# EAGLE design mLRS-rx-E22-G4-v007 (EAGLE 7.5.0)
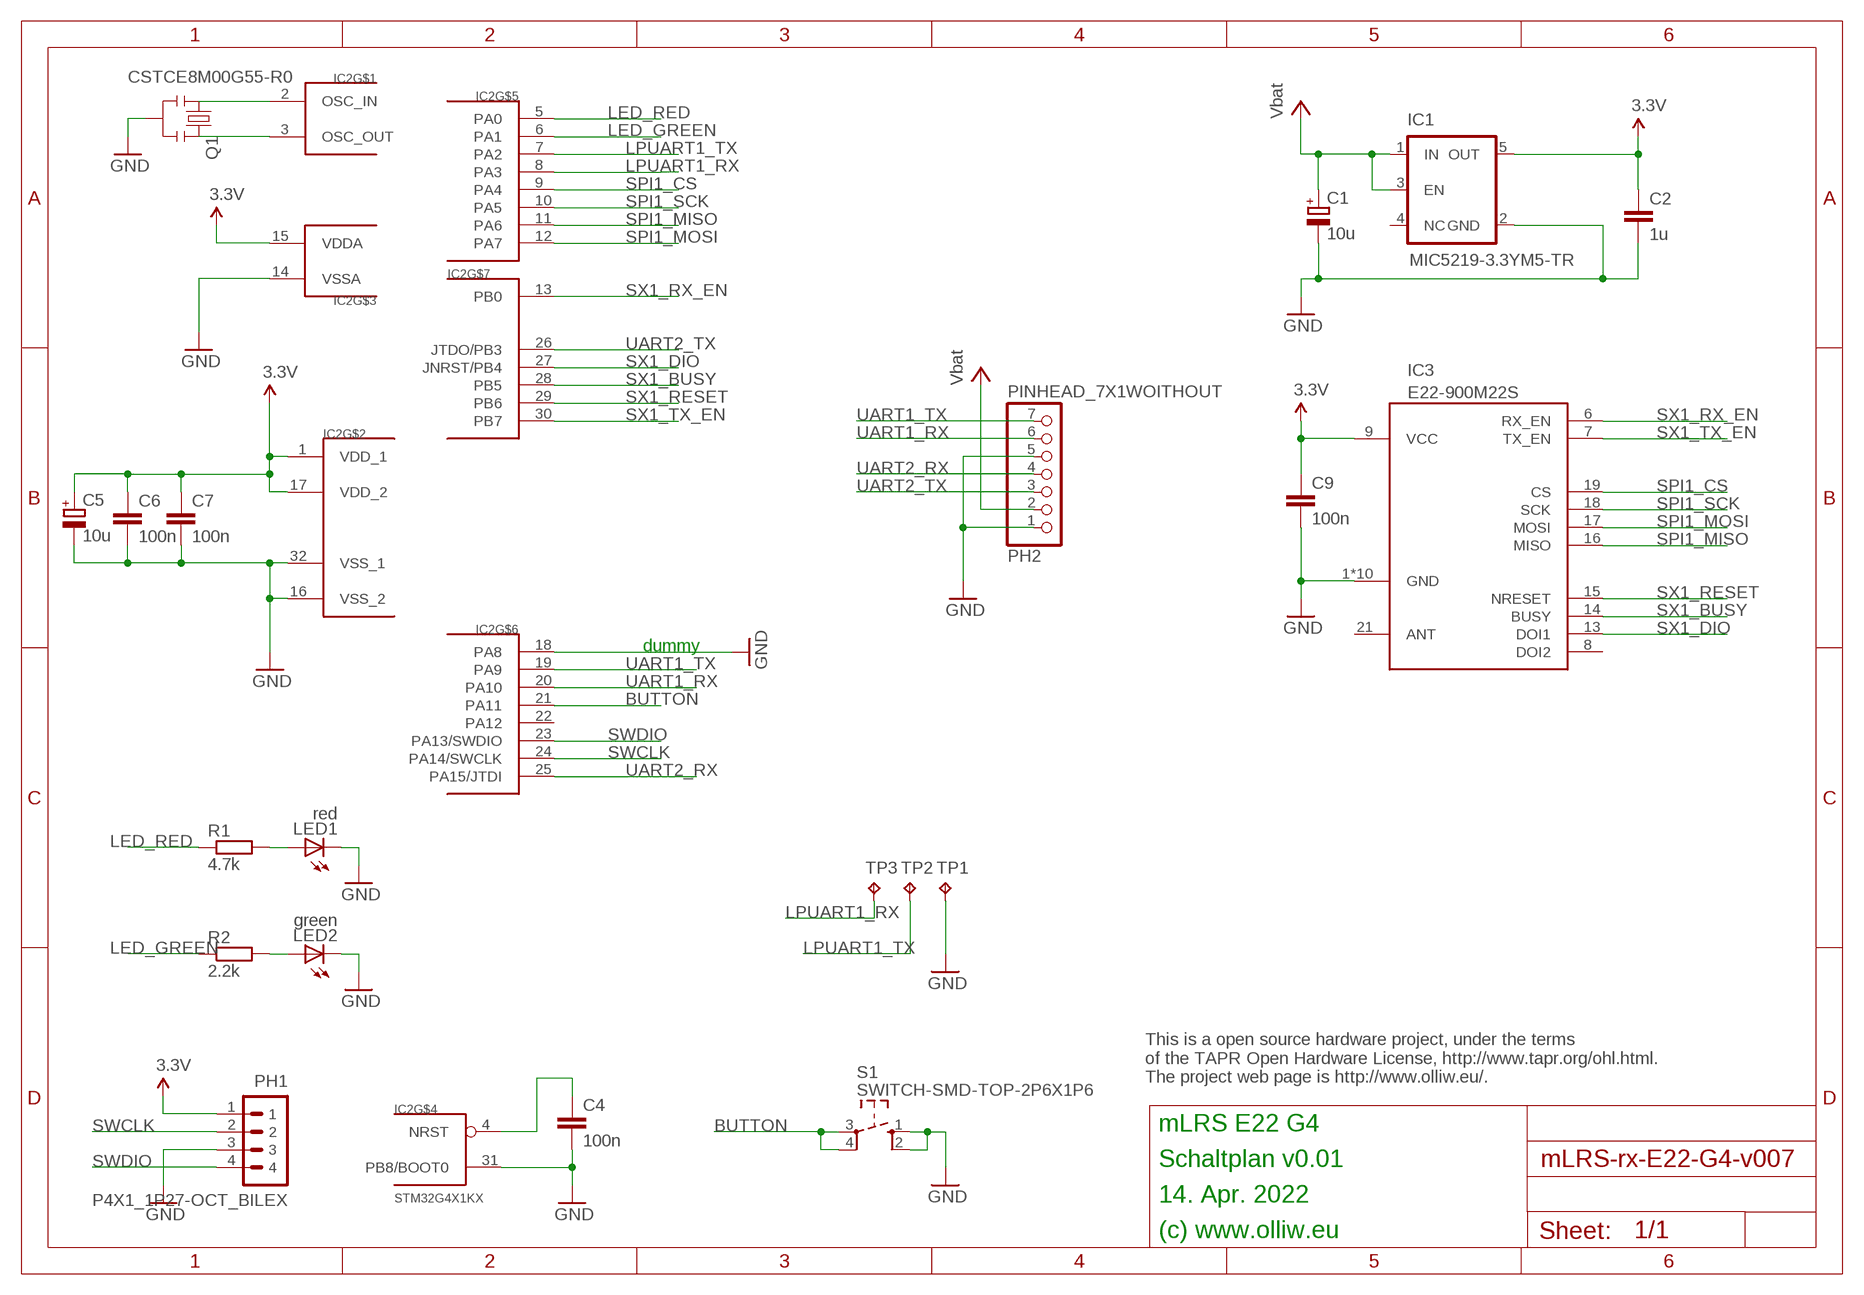
[diagram p0: schematic, sheet 1]

## Parts
C1  10u  CPOL-EUSMCA  [SMC_A]
C2  1u  C-EUC0603K  [C0603K]
C4  100n  C-EUC0402  [C0402]
C5  10u  CPOL-EUSMCA  [SMC_A]
C6  100n  C-EUC0402  [C0402]
C7  100n  C-EUC0402  [C0402]
C9  100n  C-EUC0402  [C0402]
IC1  MIC5219-3.3YM5-TR  V_REG_TPS76433SOT23-5  [SOT23-5]
IC2  STM32G4X1KX  [UFQFPN32]
IC3  E22-900M22S  [E22-900M22S]
LED1  red  LEDCHIPLED_0603  [CHIPLED_0603]
LED2  green  LEDCHIPLED_0603  [CHIPLED_0603]
PH1  P4X1_1P27-OCT_BILEX  [4X1_1P27_OCT_BILEX]
PH2  PINHEAD_7X1WOITHOUT  [PINHEAD_7X1_WO]
Q1  CSTCE8M00G55-R0  RESONATORSMD  [RESONATOR-SMD]
R1  4.7k  R-EU_R0402  [R0402]
R2  2.2k  R-EU_R0402  [R0402]
S1  SWITCH-SMD-TOP-2P6X1P6  [TACTILE-SWITCH-SMD-TOP-2P6X1X6]
TP1  TPB1,27  [B1,27]
TP2  TPB1,27  [B1,27]
TP3  TPB1,27  [B1,27]

## Nets
3.3V: C2.1 C5.+ C6.1 C7.1 C9.1 IC1.5(OUT) IC2.1(VDD_1) IC2.15(VDDA) IC2.17(VDD_2) IC3.9(VCC) PH1.1
BUTTON: IC2.21(PA11) S1.3 S1.4
GND: C1.- C2.2 C4.2 C5.- C6.2 C7.2 C9.2 IC1.2(GND) IC2.14(VSSA) IC2.16(VSS_2) IC2.18(PA8) IC2.31(PB8/BOOT0) IC2.32(VSS_1) IC3.1(GND) IC3.2(GND) IC3.3(GND) IC3.4(GND) IC3.5(GND) IC3.10(GND) IC3.11(GND) IC3.12(GND) IC3.20(GND) IC3.22(GND) LED1.C LED2.C PH1.3 PH2.1 PH2.5 Q1.2 S1.1 S1.2 TP1.TP
LED_GREEN: IC2.6(PA1) R2.1
LED_RED: IC2.5(PA0) R1.1
LPUART1_RX: IC2.8(PA3) TP3.TP
LPUART1_TX: IC2.7(PA2) TP2.TP
N$5: C4.1 IC2.4(NRST)
N$12: IC2.3(OSC_OUT) Q1.3
N$14: IC2.2(OSC_IN) Q1.1
N$17: LED1.A R1.2
N$19: LED2.A R2.2
SPI1_CS: IC2.9(PA4) IC3.19(CS)
SPI1_MISO: IC2.11(PA6) IC3.16(MISO)
SPI1_MOSI: IC2.12(PA7) IC3.17(MOSI)
SPI1_SCK: IC2.10(PA5) IC3.18(SCK)
SWCLK: IC2.24(PA14/SWCLK) PH1.2
SWDIO: IC2.23(PA13/SWDIO) PH1.4
SX1_BUSY: IC2.28(PB5) IC3.14(BUSY)
SX1_DIO: IC2.27(JNRST/PB4) IC3.13(DOI1)
SX1_RESET: IC2.29(PB6) IC3.15(NRESET)
SX1_RX_EN: IC2.13(PB0) IC3.6(RX_EN)
SX1_TX_EN: IC2.30(PB7) IC3.7(TX_EN)
UART1_RX: IC2.20(PA10) PH2.6
UART1_TX: IC2.19(PA9) PH2.7
UART2_RX: IC2.25(PA15/JTDI) PH2.4
UART2_TX: IC2.26(JTDO/PB3) PH2.3
VCC: C1.+ IC1.1(IN) IC1.3(EN) PH2.2 ; supply symbol labelled Vbat
Unconnected: IC1.4(NC) IC2.22(PA12) IC3.8(DOI2) IC3.21(ANT)

## Notes on the sheet
- dummy
- This is a open source hardware project, under the terms
  of the TAPR Open Hardware License, http://www.tapr.org/ohl.html.
  The project web page is http://www.olliw.eu/.
- mLRS E22 G4
- Schaltplan v0.01
- 14. Apr. 2022
- (c) www.olliw.eu

## Library data of the parts
C1 C5 = rcl:CPOL-EU: POLARIZED CAPACITOR, European symbol
C2 C4 C6 C7 C9 = rcl:C-EU: CAPACITOR, European symbol
IC1 = # SparkFun2:V_REG_TPS76433: Voltage Regulator Older TI part. LDO 150mA regulator. No output by-pass cap option. See V_REG_LDO for a better part.
IC2 = # stm32:STM32G4X1KX
IC3 = # stdlib:E22-900M22S
LED1 LED2 = led:LED: LED OSRAM: - CHIPLED LG R971, LG N971, LY N971, LG Q971, LY Q971, LO R971, LY R971 LH N974, LH R974 LS Q976, LO Q976, LY Q976 LO Q996 - Hyper CHIPLED LW Q18S LB Q993, LB Q99A, LB R99A - SideLED LS A670, LO A670, LY A670, LG A670, LP A670 LB A673, LV A673, LT A673, LW A673 LH A674 LY A675 LS A676, LA A676, LO A676, LY A676, LW A676 LS A679, LY A679, LG A679 - Hyper Micro SIDELED® LS Y876, LA Y876, LO Y876, LY Y876 LT Y87S - SmartLED LW L88C, LW L88S LB L89C, LB L89S, LG L890 LS L89K, LO L89K, LY L89K LS L896, LA L896, LO L896, LY L896 - TOPLED LS T670, LO T670, LY T670, LG T670, LP T670 LSG T670, LSP T670, LSY T670, LOP T670, LYG T670 LG T671, LOG T671, LSG T671 LB T673, LV T673, LT T673, LW T673 LH T674 LS T676, LA T676, LO T676, LY T676, LB T676, LH T676, LSB T676, LW T676 LB T67C, LV T67C, LT T67C, LS T67K, LO T67K, LY T67K, LW E67C LS E67B, LA E67B, LO E67B, LY E67B, LB E67C, LV E67C, LT E67C LW T67C LS T679, LY T679, LG T679 LS T770, LO T770, LY T770, LG T770, LP T770 LB T773, LV T773, LT T773, LW T773 LH T774 LS E675, LA E675, LY E675, LS T675 LS T776, LA T776, LO T776, LY T776, LB T776 LHGB T686 LT T68C, LB T68C - Hyper Mini TOPLED® LB M676 - Mini TOPLED Santana® LG M470 LS M47K, LO M47K, LY M47K Source: http://www.osram.convergy.de LUXEON: - LUMILED® LXK2-PW12-R00, LXK2-PW12-S00, LXK2-PW14-U00, LXK2-PW14-V00 LXK2-PM12-R00, LXK2-PM12-S00, LXK2-PM14-U00 LXK2-PE12-Q00, LXK2-PE12-R00, LXK2-PE12-S00, LXK2-PE14-T00, LXK2-PE14-U00 LXK2-PB12-K00, LXK2-PB12-L00, LXK2-PB12-M00, LXK2-PB14-N00, LXK2-PB14-P00, LXK2-PB14-Q00 LXK2-PR12-L00, LXK2-PR12-M00, LXK2-PR14-Q00, LXK2-PR14-R00 LXK2-PD12-Q00, LXK2-PD12-R00, LXK2-PD12-S00 LXK2-PH12-R00, LXK2-PH12-S00 LXK2-PL12-P00, LXK2-PL12-Q00, LXK2-PL12-R00 Source: www.luxeon.com KINGBRIGHT: KA-3528ASYC Source: www.kingbright.com
PH1 = # stdlib:P4X1_1P27
PH2 = # stdlib:PINHEAD_7X1
Q1 = # SparkFun2:RESONATOR: Resonator Small SMD resonator. This is the itty bitty 10/20MHz resonators with built in caps. CSTCE10M0G55 and CSTCE20M0V53. Footprint has been reviewed closely but hasn't been tested yet.
R1 R2 = rcl:R-EU_: RESISTOR, European symbol
S1 = # stdlib:SWITCH-SMD-TOP-2P6X1P6
TP1-TP3 = testpad:TP: Test pad

## Board
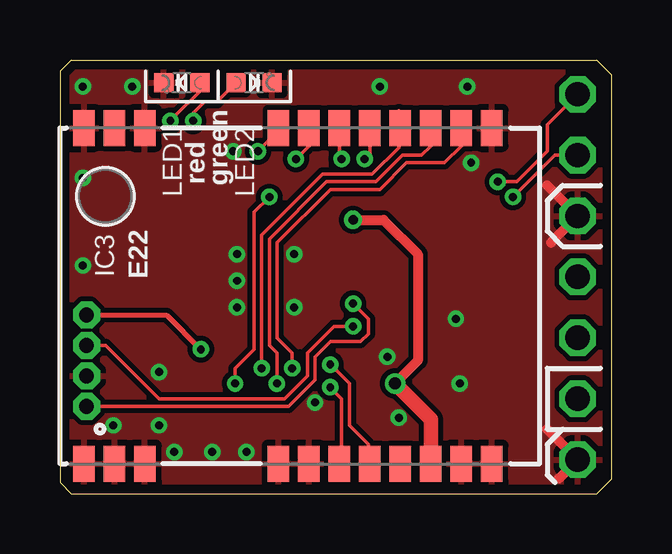
[diagram p1: board, top side]
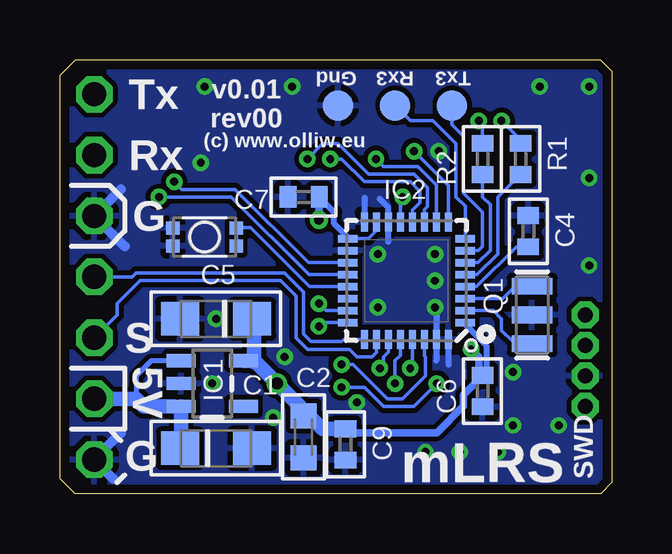
[diagram p2: board, bottom side, seen from below]

Size 23.02 x 18.1 mm. Coordinates in mm from the lower left corner, seen from the top.
Outline: 22.38,0 23.02,0.64 23.02,17.46 22.38,18.1 0.48,18.1 0,17.62 0,0.48 0.48,0 22.38,0
Copper layers (1*16): Top 0.0356mm / dielectric 1.5011mm / Bottom 0.0356mm
Design rules "ow-oshpark-2layer": minimum track width 6mil, minimum drill 13mil, track to track 6mil, track to pad 6mil, pad to pad 6mil, via to via 6mil, smd to smd 6mil, copper to edge 15mil, drill to drill 6mil, minimum pad ring 7mil, minimum via ring 7mil, stop-mask expansion 2.5mil, vias tented up to drill 26mil, thermal gap 10mil

### Footprints (pad centres in the part's own frame; a part is rotated, then mirrored left to right if it is on the bottom)
SMC_A = smd 1.6 x 1.4: + -1.5,0; - 1.5,0
C0603K = smd 1.05 x 1.08: 1 -0.875,0; 2 0.875,0
C0402 = smd 0.7 x 0.9: 1 -0.65,0; 2 0.65,0
SOT23-5 = smd 0.55 x 1.2: 1 -0.95,-1.3; 2 0,-1.3; 3 0.95,-1.3; 4 0.95,1.3; 5 -0.95,1.3
UFQFPN32 = smd 0.8 x 0.3: 1 -2.45,1.75; 2 -2.45,1.25; 3 -2.45,0.75; 4 -2.45,0.25; 5 -2.45,-0.25; 6 -2.45,-0.75; 7 -2.45,-1.25; 8 -2.45,-1.75; 17 2.45,-1.75; 18 2.45,-1.25; 19 2.45,-0.75; 20 2.45,-0.25; 21 2.45,0.25; 22 2.45,0.75; 23 2.45,1.25; 24 2.45,1.75 | smd 0.3 x 0.8: 9 -1.75,-2.45; 10 -1.25,-2.45; 11 -0.75,-2.45; 12 -0.25,-2.45; 13 0.25,-2.45; 14 0.75,-2.45; 15 1.25,-2.45; 16 1.75,-2.45; 25 1.75,2.45; 26 1.25,2.45; 27 0.75,2.45; 28 0.25,2.45; 29 -0.25,2.45; 30 -0.75,2.45; 31 -1.25,2.45; 32 -1.75,2.45
E22-900M22S = smd 1.5 x 0.9: 1 -7,9; 2 -7,7.73; 3 -7,6.46; 4 -7,0.89; 5 -7,-0.38; 6 -7,-1.65; 7 -7,-2.92; 8 -7,-4.19; 9 -7,-5.46; 10 -7,-6.73; 11 -7,-8; 12 7,-8; 13 7,-6.73; 14 7,-5.46; 15 7,-4.19; 16 7,-2.92; 17 7,-1.65; 18 7,-0.38; 19 7,0.89; 20 7,6.46; 21 7,7.73; 22 7,9
CHIPLED_0603 = smd 0.8 x 0.8: A 0,-0.75; C 0,0.75
4X1_1P27_OCT_BILEX = drill 0.61 pad 1.118 octagon: 1 0,0; 2 0,-1.27; 3 0,-2.54; 4 0,-3.81
PINHEAD_7X1_WO = drill 1.016 octagon: 1 0,0; 2 0,-2.54; 3 0,-5.08; 4 0,-7.62; 5 0,-10.16; 6 0,-12.7; 7 0,-15.24
RESONATOR-SMD = smd 0.7 x 1.7: 1 -1.2,0; 2 0,0; 3 1.2,0
R0402 = smd 0.7 x 0.9: 1 -0.65,0; 2 0.65,0
TACTILE-SWITCH-SMD-TOP-2P6X1X6 = smd 0.55 x 0.55: 1 -1.325,0.375; 2 -1.325,-0.375; 3 1.325,-0.375; 4 1.325,0.375
B1,27 = smd 1.27 x 1.27: TP 0,0

### Placement (x,y rotation side)
C1  16.51,1.91 0 bottom
C2  12.86,2.38 270 bottom
C4  3.49,10.95 90 bottom
C5  16.51,7.3 180 bottom
C6  5.4,4.29 270 bottom
C7  12.86,12.38 180 bottom
C9  11.11,2.06 270 bottom
IC1  16.67,4.6 270 bottom
IC2  8.57,8.89 180 bottom
IC3  10,8.26 90 top
LED1  5.08,17.14 90 top
LED2  8.1,17.14 270 top
PH1  1.11,7.46 0 top
PH2  21.59,1.43 180 top
Q1  3.33,7.46 90 bottom
R1  3.81,13.97 90 bottom
R2  5.4,13.97 90 bottom
S1  16.99,10.72 0 bottom
TP1  11.43,16.19 0 bottom
TP2  6.67,16.19 0 bottom
TP3  9.05,16.19 0 bottom

### Tracks (layer width: path | path; a pad name or v marks a point on that pad's centre or on a via)
3.3V  (via drill 0.33, 0.4, 0.5)
  Top 0.203: PH1.1 4.44,7.46 v5.87,6.03
  Top 0.406: v12.22,11.43 13.49,11.43 14.92,10 14.92,5.56 v13.97,4.6
  Top 0.61: IC3.9 15.46,3.11 v13.97,4.6
  Bottom 0.152: IC2.15 9.82,10.97 10.16,10.64 IC2.17
  Bottom 0.254: IC2.17 11.02,10.71 11.59,11.27 11.59,11.75 11.89,12.05 C7.1 12.22,12.37 | IC2.1 6.19,7.14 5.24,6.19 5.24,5.24 5.38,5.1 C6.1 5.54,5.1 5.56,5.08
  Bottom 0.305: 5.56,5.08 5.56,5.72 v5.87,6.03 | v12.22,11.43 12.22,12.37 | C9.1 10.97,2.71 10.79,2.54 7.3,2.56 6.19,3.67 6.19,4.13 5.54,4.78 C6.1 5.24,5.1
  Bottom 0.61: IC1.5 15.08,5.55 14.84,5.48 | 14.84,5.48 v13.97,4.6 13.02,3.65 C2.1 12.94,3.18 12.54,3.18 12.08,2.71 C9.1 | C5.+ 14.92,7.3 14.92,5.56 14.84,5.48
BUTTON
  Bottom 0.152: S1.3 S1.4 15.6,11.11 15.08,11.11 12.61,8.64 IC2.21
GND  (via drill 0.33)
  Top 0.406: 20.32,2.7 PH2.1 20.8,0.64 | 20.32,12.86 PH2.5 20.48,10.48
  Bottom 0.152: IC2.32
  Bottom 0.254: 6.83,6.67 IC2.32 6.82,5.4 | 7.32,7.46 7.32,5.56 | 10.32,12.35 10.32,11.08 | 9.33,10.52 9.33,11.95 9.68,12.3
  Bottom 0.406: 20.48,2.54 PH2.1 20.8,0.64 | 20.48,12.7 PH2.5 20.32,10.32
  other vias: 9.76,7.78 7.38,8.89 7.38,10 9.76,10 0.95,13.18 0.95,9.53 0.95,16.99 7.38,7.78 2.22,2.86 4.13,2.86 4.76,1.75 7.78,1.75 10.64,3.81 16.67,4.6 16.51,7.3 13.65,5.71 14.13,3.18 13.34,16.99 16.99,16.99 17.14,13.81 6.35,1.75 7.22,14.29 3.02,16.99 4.13,5.08
  pour Bottom (isolate 0.203, rank 6): 0.32,17.94 22.7,17.94 22.7,0.16 0.32,0.16
  pour Top (isolate 0.203, rank 6): 0.32,17.94 22.7,17.94 22.7,0.16 0.32,0.16
LED_GREEN
  Bottom 0.152: IC2.6 5.6,9.64 5.08,10.16 5.08,12.07 5.4,12.38 R2.1
LED_RED
  Bottom 0.152: IC2.5 5.62,9.14 4.76,10 4.76,12.38 4.14,13 R1.1
LPUART1_RX
  Bottom 0.152: IC2.8 6.12,12 6.51,12.38 6.51,14.61 7.46,15.56 8.41,15.56 TP3.TP
LPUART1_TX
  Bottom 0.152: IC2.7 5.58,10.14 5.4,10.32 5.4,11.75 6.19,12.54 6.19,14.92 6.67,15.4 TP2.TP
N$5
  Bottom 0.152: IC2.4 5.65,8.64 3.98,10.3 C4.1
N$12
  Bottom 0.152: IC2.3 4.56,8.14 4.13,8.57 3.42,8.57 Q1.3
N$14
  Bottom 0.152: IC2.2 4.94,7.64 4.6,7.3 4.6,6.83 4.13,6.35 3.42,6.51 Q1.1
N$17  (via drill 0.33)
  Top 0.152: v4.6,15.56 5.99,16.94 LED1.A
  Bottom 0.152: R1.2 3.81,14.76 v4.6,15.56
N$19  (via drill 0.33)
  Top 0.152: v5.56,15.56 5.56,15.88 6.03,16.35 6.55,16.35 LED2.A
  Bottom 0.152: R2.2 5.4,15.4 v5.56,15.56
SPI1_CS  (via drill 0.33)
  Top 0.152: v8.25,14.29 8.81,14.84 8.81,14.95 IC3.19
  Bottom 0.152: IC2.9 6.82,12.86 v8.25,14.29
SPI1_MISO  (via drill 0.33)
  Top 0.152: IC3.16 12.92,14.19 v12.7,13.97
  Bottom 0.152: v12.7,13.97 12.06,14.61 11.43,14.61 10.16,13.34 8.25,13.34 7.7,12.78 7.7,11.99 7.82,11.86 IC2.11
SPI1_MOSI  (via drill 0.33)
  Top 0.152: IC3.17 11.65,14.07 v11.75,13.97
  Bottom 0.152: v11.75,13.97 11.27,13.97 10.32,13.02 8.41,13.02 8,12.61 8.02,12.6 8.02,12.14 8.32,11.84 IC2.12
SPI1_SCK  (via drill 0.33)
  Top 0.152: IC3.18 10.38,14.51 v9.84,13.97
  Bottom 0.152: IC2.10 7.32,12.88 8.1,13.65 9.52,13.65 v9.84,13.97
SWCLK  (via drill 0.33)
  Top 0.152: v12.22,6.99 11.43,6.99 10.32,5.87 10.32,4.92 9.37,3.97 4.13,3.97 1.9,6.19 PH1.2
  Bottom 0.152: IC2.24 12.06,7.14 v12.22,6.99
SWDIO  (via drill 0.33)
  Top 0.152: PH1.4 9.52,3.65 10.64,4.76 10.64,5.72 11.27,6.35 12.54,6.35 12.86,6.67 12.86,7.3 v12.22,7.94
  Bottom 0.152: IC2.23 11.93,7.64 v12.22,7.94
SX1_BUSY  (via drill 0.33)
  Top 0.152: IC3.14 15.46,14.51 15.08,14.13 14.29,14.13 13.18,13.02 11.11,13.02 8.73,10.64 8.73,6.19 9.05,5.87 v9.05,4.6
  Bottom 0.152: IC2.28 8.82,5.78 9.05,5.56 v9.05,4.6
SX1_DIO  (via drill 0.33)
  Top 0.152: IC3.13 16.73,14.51 16.03,13.81 14.45,13.81 13.33,12.7 11.27,12.7 9.05,10.48 9.05,6.51 9.68,5.87 v9.68,5.24
  Bottom 0.152: IC2.27 9.32,5.92 9.52,5.72 9.52,5.4 v9.68,5.24
SX1_RESET  (via drill 0.33)
  Top 0.152: v8.41,5.24 8.41,10.8 10.95,13.34 13.02,13.34 14.13,14.45 14.13,15.99 IC3.15
  Bottom 0.152: IC2.29 8.32,5.31 v8.41,5.24
SX1_RX_EN  (via drill 0.33)
  Top 0.152: v11.27,4.45 11.75,3.97 11.75,1.79 IC3.6 | v7.3,4.6 7.3,5.24 8.1,6.03 8.1,11.75 v8.73,12.38
  Bottom 0.152: v7.3,4.6 8.25,3.65 9.52,3.65 10.32,4.45 v11.27,4.45 | IC2.13 8.82,12.29 v8.73,12.38
SX1_TX_EN  (via drill 0.33)
  Top 0.152: v11.27,5.4 12.06,4.6 12.06,2.86 12.86,2.06 12.86,1.64 IC3.7
  Bottom 0.152: IC2.30 7.82,5.76 7.78,5.72 7.78,4.92 8.73,3.97 9.37,3.97 10.79,5.4 v11.27,5.4
UART1_RX  (via drill 0.33)
  Top 0.152: v18.89,12.38 20.64,14.13 PH2.6
  Bottom 0.152: IC2.20 12.63,9.14 15.87,12.38 v18.89,12.38
UART1_TX  (via drill 0.33)
  Top 0.152: v18.26,13.02 19.05,13.02 20.32,14.29 20.32,15.4 PH2.7
  Bottom 0.152: IC2.19 12.66,9.64 15.72,12.7 17.94,12.7 v18.26,13.02
UART2_RX
  Bottom 0.152: IC2.25 11.18,6.44 11.27,6.35 12.54,6.35 12.86,6.67 12.86,8.41 13.65,9.21 19.84,9.21 20,9.05 PH2.4
UART2_TX
  Bottom 0.152: IC2.26 9.82,5.89 10,5.72 10.64,5.72 10.95,6.03 12.7,6.03 13.18,6.51 13.18,8.26 13.81,8.89 19.68,8.89 20.64,7.94 20.64,7.46 PH2.3
VCC
  Bottom 0.203: IC1.1 19.21,5.55 19.84,4.92 19.84,3.97
  Bottom 0.406: 17.97,1.79 C1.+ | 18.29,3.65 IC1.3
  Bottom 0.61: IC1.3 17.97,1.79 | 18.29,3.65 19.53,3.65 19.84,3.97 PH2.2

### Text on the board
tNames: green | red | E22
bNames: Tx3 | Rx3 | Gnd | v0.01 / rev00 | Tx | (c) www.olliw.eu | Rx | G | 5V | S | SWD | mLRS | G